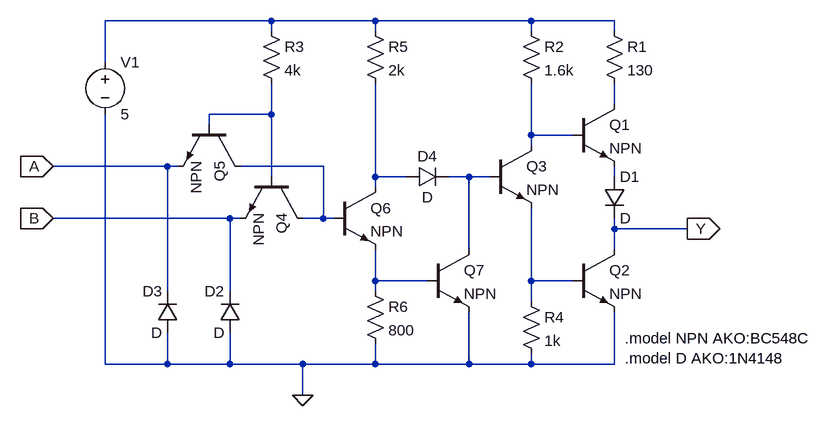
[diagram p0: schematic AND.asc]
AND.asc, the LTspice schematic file:
Version 4
SHEET 1 880 680
WIRE -32 -64 -288 -64
WIRE 128 -64 -32 -64
WIRE 368 -64 128 -64
WIRE 496 -64 368 -64
WIRE -32 -48 -32 -64
WIRE 128 -48 128 -64
WIRE 368 -48 368 -64
WIRE 496 -48 496 -64
WIRE -288 0 -288 -64
WIRE 496 64 496 32
WIRE -32 80 -32 32
WIRE -32 80 -128 80
WIRE -128 96 -128 80
WIRE 368 112 368 32
WIRE 432 112 368 112
WIRE 368 128 368 112
WIRE -192 160 -368 160
WIRE -176 160 -192 160
WIRE 48 160 -80 160
WIRE -32 176 -32 80
WIRE 128 176 128 32
WIRE 176 176 128 176
WIRE 272 176 240 176
WIRE 304 176 272 176
WIRE 496 176 496 160
WIRE 128 192 128 176
WIRE -96 240 -368 240
WIRE -80 240 -96 240
WIRE 48 240 48 160
WIRE 48 240 16 240
WIRE 64 240 48 240
WIRE 496 256 496 240
WIRE 608 256 496 256
WIRE 272 288 272 176
WIRE 496 288 496 256
WIRE 128 336 128 288
WIRE 208 336 128 336
WIRE 368 336 368 224
WIRE 432 336 368 336
WIRE -192 352 -192 160
WIRE -96 352 -96 240
WIRE 128 352 128 336
WIRE 368 368 368 336
WIRE -288 464 -288 80
WIRE -192 464 -192 416
WIRE -192 464 -288 464
WIRE -96 464 -96 416
WIRE -96 464 -192 464
WIRE 16 464 -96 464
WIRE 128 464 128 432
WIRE 128 464 16 464
WIRE 272 464 272 384
WIRE 272 464 128 464
WIRE 368 464 368 448
WIRE 368 464 272 464
WIRE 496 464 496 384
WIRE 496 464 368 464
WIRE 16 512 16 464
FLAG 16 512 0
FLAG -368 240 B
IOPIN -368 240 In
FLAG 608 256 Y
IOPIN 608 256 Out
FLAG -368 160 A
IOPIN -368 160 In
SYMBOL npn 432 64 R0
SYMATTR InstName Q1
SYMBOL npn 432 288 R0
SYMATTR InstName Q2
SYMBOL npn 304 128 R0
SYMATTR InstName Q3
SYMBOL npn 16 176 R90
SYMATTR InstName Q4
SYMBOL res 480 -64 R0
SYMATTR InstName R1
SYMATTR Value 130
SYMBOL res 352 -64 R0
SYMATTR InstName R2
SYMATTR Value 1.6k
SYMBOL res -48 -64 R0
SYMATTR InstName R3
SYMATTR Value 4k
SYMBOL res 352 352 R0
SYMATTR InstName R4
SYMATTR Value 1k
SYMBOL diode 480 176 R0
SYMATTR InstName D1
SYMBOL diode -80 416 R180
WINDOW 0 24 64 Left 2
WINDOW 3 24 0 Left 2
SYMATTR InstName D2
SYMBOL voltage -288 -16 R0
WINDOW 123 0 0 Left 2
WINDOW 39 0 0 Left 2
SYMATTR InstName V1
SYMATTR Value 5
SYMBOL npn -80 96 R90
SYMATTR InstName Q5
SYMBOL diode -176 416 R180
WINDOW 0 24 64 Left 2
WINDOW 3 24 0 Left 2
SYMATTR InstName D3
SYMBOL npn 64 192 R0
SYMATTR InstName Q6
SYMBOL diode 176 160 M90
WINDOW 0 0 32 VBottom 2
WINDOW 3 32 32 VTop 2
SYMATTR InstName D4
SYMBOL npn 208 288 R0
SYMATTR InstName Q7
SYMBOL res 112 -64 R0
SYMATTR InstName R5
SYMATTR Value 2k
SYMBOL res 112 336 R0
SYMATTR InstName R6
SYMATTR Value 800
TEXT 512 424 Left 2 !.model NPN AKO:BC548C\n.model D AKO:1N4148

The netlist it stands for:
* AND.asc
Q1 N002 N004 N008 0 NPN
Q2 Y N010 0 0 NPN
Q3 N004 N007 N010 0 NPN
Q4 N005 N003 B 0 NPN
R1 N001 N002 130
R2 N001 N004 1.6k
R3 N001 N003 4k
R4 N010 0 1k
D1 N008 Y D
D2 0 B D
V1 N001 0 5
Q5 N005 N003 A 0 NPN
D3 0 A D
Q6 N006 N005 N009 0 NPN
D4 N006 N007 D
Q7 N007 N009 0 0 NPN
R5 N001 N006 2k
R6 N009 0 800
.model D D
.lib standard.dio
.model NPN NPN
.model PNP PNP
.lib standard.bjt
.model NPN AKO:BC548C
.model D AKO:1N4148
.backanno
.end